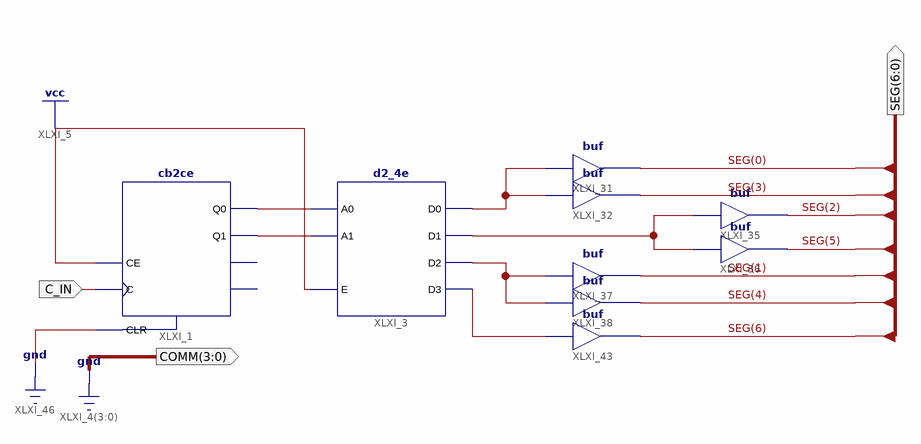
[diagram p0: schematic sheet 1]
// Xilinx ISE schematic decodeLoading.sch (spartan6) as structural Verilog: 9 symbols, 3 ports
module decodeLoading (
  input  C_IN,
  output [3:0] COMM,
  output [6:0] SEG
);

  wire XLXN_1, XLXN_2, XLXN_30, XLXN_33, XLXN_36, XLXN_45;

  cb2ce XLXI_1 (.C(C_IN), .CE(1'b1), .CLR(1'b0), .Q0(XLXN_1), .Q1(XLXN_2));  // open: CEO, TC
  d2_4e XLXI_3 (.A0(XLXN_1), .A1(XLXN_2), .E(1'b1), .D0(XLXN_30), .D1(XLXN_33), .D2(XLXN_36), .D3(XLXN_45));
  buf XLXI_31 (SEG[0], XLXN_30);
  buf XLXI_32 (SEG[3], XLXN_30);
  buf XLXI_35 (SEG[2], XLXN_33);
  buf XLXI_37 (SEG[1], XLXN_36);
  buf XLXI_38 (SEG[4], XLXN_36);
  buf XLXI_43 (SEG[6], XLXN_45);
  buf XLXI_36 (SEG[5], XLXN_33);

  assign COMM = 4'b0000;
endmodule
